# Altium project curgen.PrjPcb
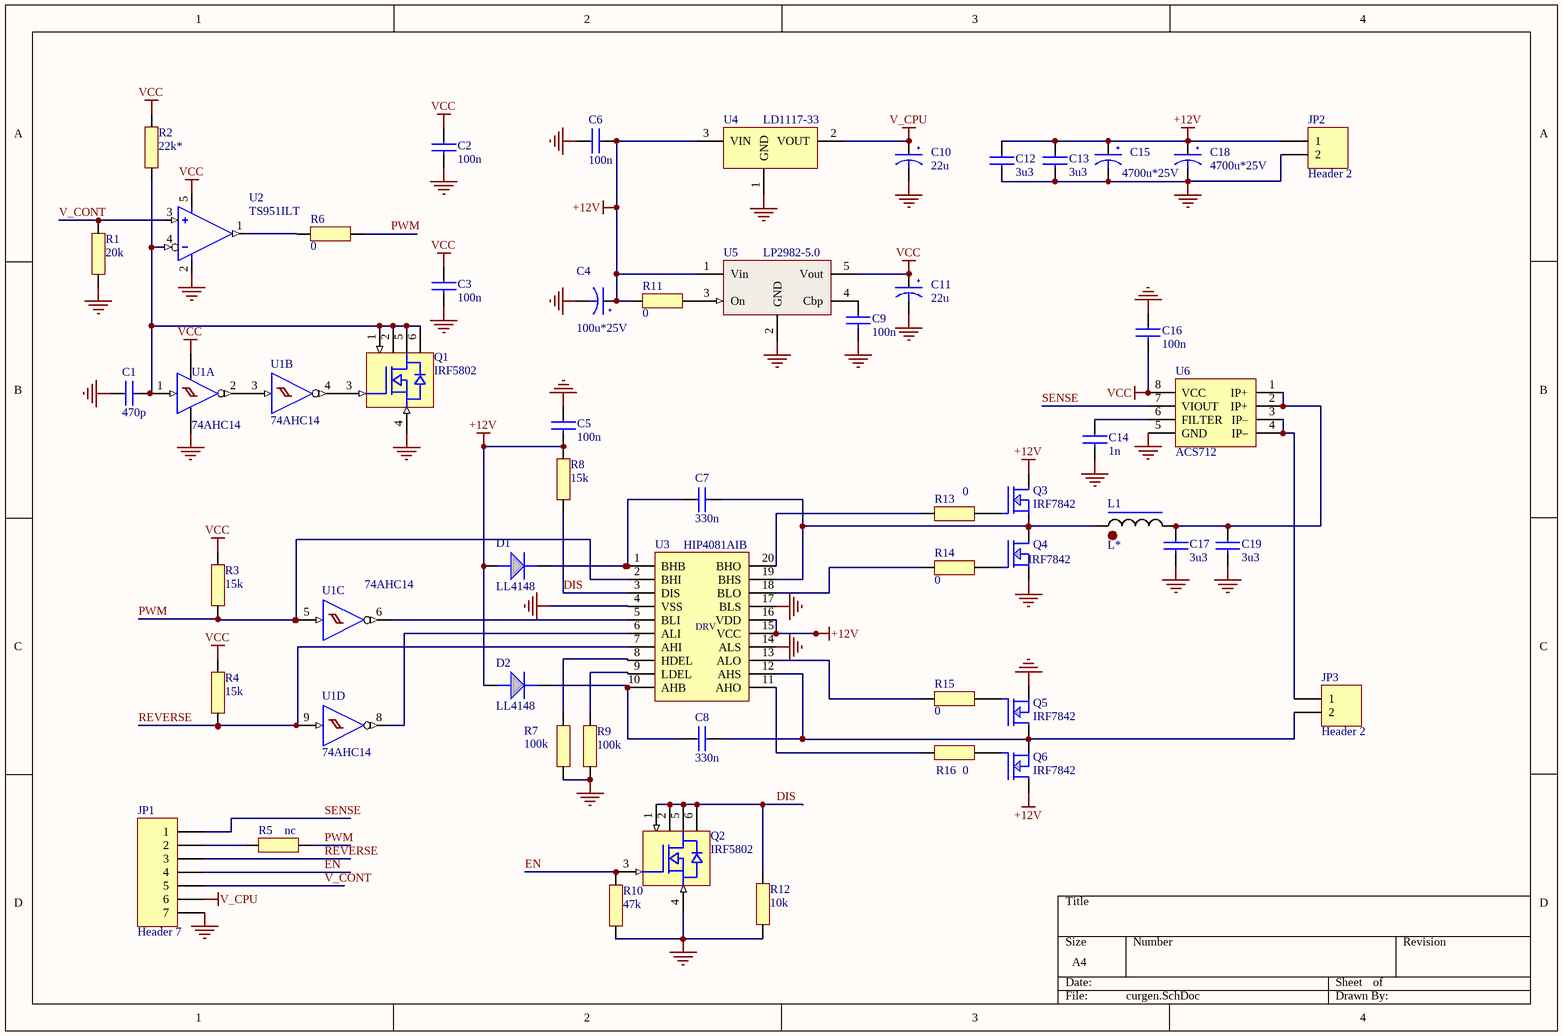
[diagram p0: curgen.SchDoc]
1 sheet, 53 parts. Net scope: global (net labels, ports and power ports of the same name join across sheets).
Board files: curgen.PcbDoc, curgen_a.PcbDoc

## Sheet curgen.SchDoc
size A4

### Parts
C1  470p  [C-0805]
C2  100n  [C-0805]
C3  100n  [C-0805]
C4  100u*25V  [EXR-6.3X11]
C5  100n  [C-0805]
C6  100n  [C-0805]
C7  330n  [C-0805]
C8  330n  [C-0805]
C9  100n  [C-0805]
C10  22u  [TANTAL-A]
C11  22u  [TANTAL-A]
C12  3u3  [C-1206]
C13  3u3  [C-1206]
C14  1n  [C-0805]
C15  4700u*25V  [EXR-10X12.5]
C16  100n  [C-0805]
C17  3u3  [C-1206]
C18  4700u*25V  [EXR-10X12.5]
C19  3u3  [C-1206]
D1  LL4148  [SOD-80]
D2  LL4148  [SOD-80]
JP1  Header 7  [HDR1X7]
JP2  Header 2  [KLEMMA2]
JP3  Header 2  [KLEMMA2]
L1  L*  [ETD34]
Q1  IRF5802  [SOT-23L-6]
Q2  IRF5802  [SOT-23L-6]
Q3  IRF7842  [SO8-(SOT-96-1)]
Q4  IRF7842  [SO8-(SOT-96-1)]
Q5  IRF7842  [SO8-(SOT-96-1)]
Q6  IRF7842  [SO8-(SOT-96-1)]
R1  20k  [R-0805]
R2  22k*  [R-0805]
R3  15k  [R-0805]
R4  15k  [R-0805]
R5  nc  [R-0805]
R6  0  [R-0805]
R7  100k  [R-0805]
R8  15k  [R-0805]
R9  100k  [R-0805]
R10  47k  [R-0805]
R11  0  [R-0805]
R12  10k  [R-0805]
R13  0  [R-0805]
R14  0  [R-0805]
R15  0  [R-0805]
R16  0  [R-0805]
U1  74AHC14  [SSOP14]  (parts A,B,C,D of 6)
U2  TS951ILT  [SOT-23-5]
U3  HIP4081AIB  [SO20-(SOT-163-1)]
U4  LD1117-33  [SOT-223-(SC-73)]
U5  LP2982-5.0  [SOT-23-5]
U6  ACS712  [SO8-(SOT-96-1)]

### Nets
1: Q3.2(SOURCE) Q3.3(SOURCE) Q4.2(SOURCE) Q4.3(SOURCE) Q5.2(SOURCE) Q5.3(SOURCE) Q6.2(SOURCE) Q6.3(SOURCE)
2: U4.4(VOUT)
5: Q3.6(DRAIN) Q3.7(DRAIN) Q3.8(DRAIN) Q4.6(DRAIN) Q4.7(DRAIN) Q4.8(DRAIN) Q5.6(DRAIN) Q5.7(DRAIN) Q5.8(DRAIN) Q6.6(DRAIN) Q6.7(DRAIN) Q6.8(DRAIN)
+12V: C4.2(+) C5.2 C6.2 C12.1 C13.1 C15.2(+) C18.2(+) D1.A D2.A JP2.1 Q3.5(DRAIN) Q6.5(DRAIN) R8.1 R11.1 U3.15(VCC) U3.16(VDD) U4.3(VIN) U5.1(Vin)
GND: C1.1 C2.2 C3.2 C4.1(-) C5.1 C6.1 C9.2 C10.1(-) C11.1(-) C12.2 C13.2 C14.2 C15.1(-) C16.1 C17.2 C18.1(-) C19.2 JP1.7 JP2.2 Q1.4(S) Q2.4(S) Q4.1(SOURCE) Q5.1(SOURCE) R1.1 R7.1 R9.1 R10.2 R12.1 U1.7(GND-D) U2.2(V-) U3.4(VSS) U3.14(ALS) U3.17(BLS) U4.1(GND) U5.2(GND) U6.5(GND)  [also labelled GND-D]
V_CPU: C10.2(+) JP1.6 U4.2(VOUT)
VCC: C2.1 C3.1 C11.2(+) C16.2 R2.1 R3.1 R4.1 U1.14(VCC) U2.5(V+) U5.5(Vout) U6.8(VCC)
DIS: Q2.1(D) Q2.2(D) Q2.5(D) Q2.6(D) R8.2 R12.2 U3.3(DIS)
EN: JP1.4 Q2.3(G) R10.1
PWM: R3.2 R5.2 R6.2 U1.5(A) U3.2(BHI)
REVERSE: JP1.3 R4.2 U1.9(A) U3.7(AHI)
SENSE: JP1.1 U6.7(VIOUT)
V_CONT: JP1.5 R1.2 U2.3(+IN)
NetC1_2: C1.2 Q1.1(D) Q1.2(D) Q1.5(D) Q1.6(D) R2.2 U1.1(A) U2.4(-IN)
NetC7_1: C7.1 D1.K U3.1(BHB)
NetC7_2: C7.2 L1.1 Q3.1(SOURCE) Q4.5(DRAIN) U3.19(BHS)
NetC8_1: C8.1 D2.K U3.10(AHB)
NetC8_2: C8.2 JP3.2 Q5.5(DRAIN) Q6.1(SOURCE) U3.12(AHS)
NetC9_1: C9.1 U5.4(Cbp)
NetC14_1: C14.1 U6.6(FILTER)
NetC17_1: C17.1 C19.1 L1.2 U6.1(IP+) U6.2(IP+)
NetJP1_2: JP1.2 R5.1
NetJP3_1: JP3.1 U6.3(IP–) U6.4(IP–)
NetQ1_3: Q1.3(G) U1.4(Y)
NetQ3_4: Q3.4(GATE) R13.2
NetQ4_4: Q4.4(GATE) R14.2
NetQ5_4: Q5.4(GATE) R15.2
NetQ6_4: Q6.4(GATE) R16.2
NetR6_1: R6.1 U2.1(OUT)
NetR7_2: R7.2 U3.8(HDEL)
NetR9_2: R9.2 U3.9(LDEL)
NetR11_2: R11.2 U5.3(On)
NetR13_1: R13.1 U3.20(BHO)
NetR14_1: R14.1 U3.18(BLO)
NetR15_1: R15.1 U3.13(ALO)
NetR16_1: R16.1 U3.11(AHO)
NetU1_2: U1.2(Y) U1.3(A)
NetU1_6: U1.6(Y) U3.5(BLI)
NetU1_8: U1.8(Y) U3.6(ALI)

### Notes on the sheet
- (in symbol HIP4081AIB) DRV

### Library data of the parts
C1-C3 C5-C9 C12-C14 C16 C17 C19 = C: Производитель: *; Точность: *; Напряжение: *; Тип диэлектрика: *
C4 C15 C18 = C-EL-DIP: Производитель: *; Точность: *; Напряжение: *; Тип диэлектрика: *
C10 C11 = C-EL-TAN: Производитель: *; Точность: *; Напряжение: *; Тип диэлектрика: *
D1 D2 = DIODE
JP1 = Header 7: Header, 7-Pin; LatestRevisionDate: 17-Jul-2002; LatestRevisionNote: Re-released for DXP Platform.; Publisher: Altium Limited
JP2 JP3 = Header 2: Header, 2-Pin; LatestRevisionDate: 17-Jul-2002; LatestRevisionNote: Re-released for DXP Platform.; Publisher: Altium Limited
Q1 Q2 = MOSFET N SOT23-6
R1-R16 = R: Производитель: *; Точность: *; Тип: *
U1 = 74AHC14: Hex Inverter With Schmitt Trigger; Производитель: *; Допустимая замена: *; Цена: *; PDF файл: *; Температурный диапазон: *
U2 = TS951ILT: RAIL TO RAIL single BiCMOS; Производитель: *; Допустимая замена: *; Цена: *; PDF файл: *; Температурный диапазон: *
U4 = LD1117
U5 = LP2982: 50mA Ultra Low-Dropout Regulator; Производитель: *; Допустимая замена: *; Цена: *; PDF файл: *; Температурный диапазон: *